# EAGLE design EMG-bi-single (EAGLE 7.1.0)
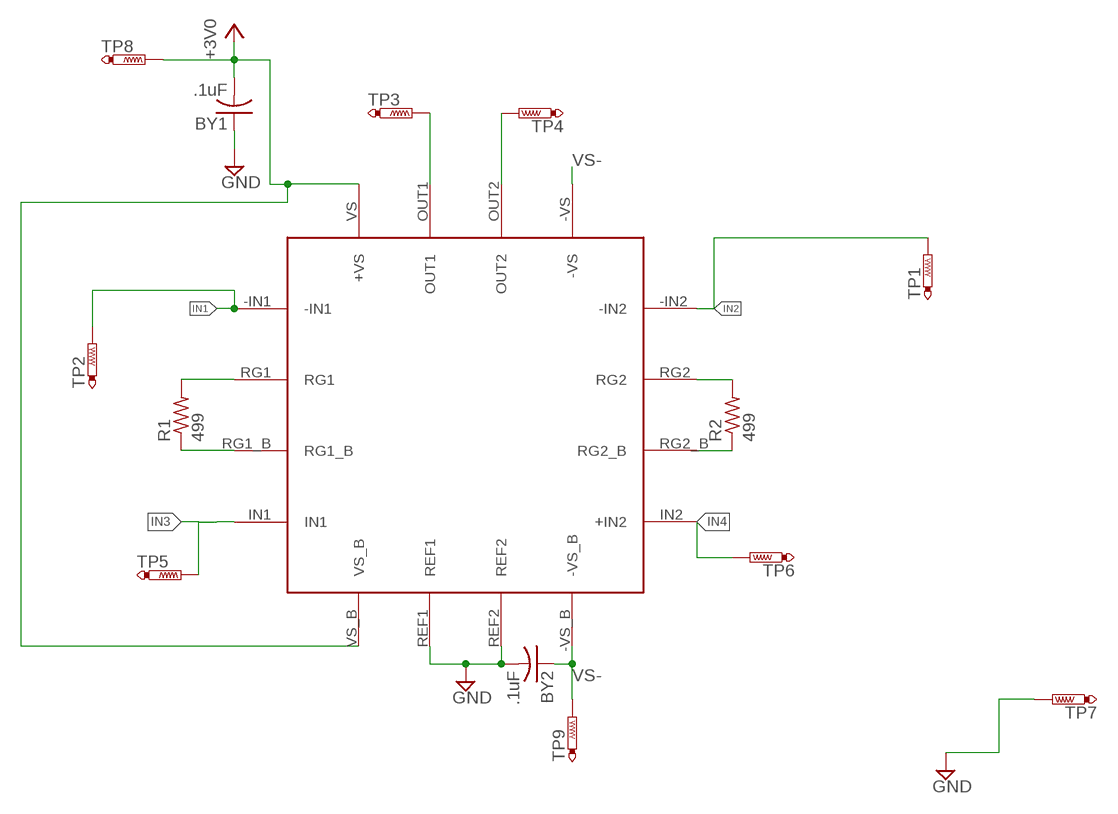
[diagram p0: schematic, sheet 1]

## Parts
BY1  .1uF  C-USC0805  [C0805]
BY2  .1uF  C-USC0805  [C0805]
R1  499  R-US_R0805  [R0805]
R2  499  R-US_R0805  [R0805]
TP1  PTR1TP20SQ  [TP20SQ]
TP2  PTR1TP20SQ  [TP20SQ]
TP3  PTR1TP20SQ  [TP20SQ]
TP4  PTR1TP20SQ  [TP20SQ]
TP5  PTR1TP20SQ  [TP20SQ]
TP6  PTR1TP20SQ  [TP20SQ]
TP7  PTR1TP20SQ  [TP20SQ]
TP8  PTR1TP20SQ  [TP20SQ]
TP9  PTR1TP20SQ  [TP20SQ]
U$9  AD8222  [QFN-16]

## Nets
+3V0: BY1.2 TP8.TP U$9.VS(+VS) U$9.VS_B
GND: BY1.1 BY2.2 TP7.TP U$9.REF1 U$9.REF2
IN1: TP2.TP U$9.-IN1
IN2: TP1.TP U$9.-IN2
IN3: TP5.TP U$9.IN1
IN4: TP6.TP U$9.IN2(+IN2)
N$1: R1.2 U$9.RG1
N$2: R1.1 U$9.RG1_B
N$3: R2.2 U$9.RG2
N$4: TP3.TP U$9.OUT1
N$5: R2.1 U$9.RG2_B
N$6: TP4.TP U$9.OUT2
VS-: BY2.1 TP9.TP U$9.-VS U$9.-VS_B

## Library data of the parts
BY1 BY2 = adafruit:C-US: CAPACITOR, American symbol
R1 R2 = adafruit:R-US_: RESISTOR, American symbol
TP1-TP9 = testpad:PTR1: TEST PIN
U$9 = kushal:AD8222

## Board
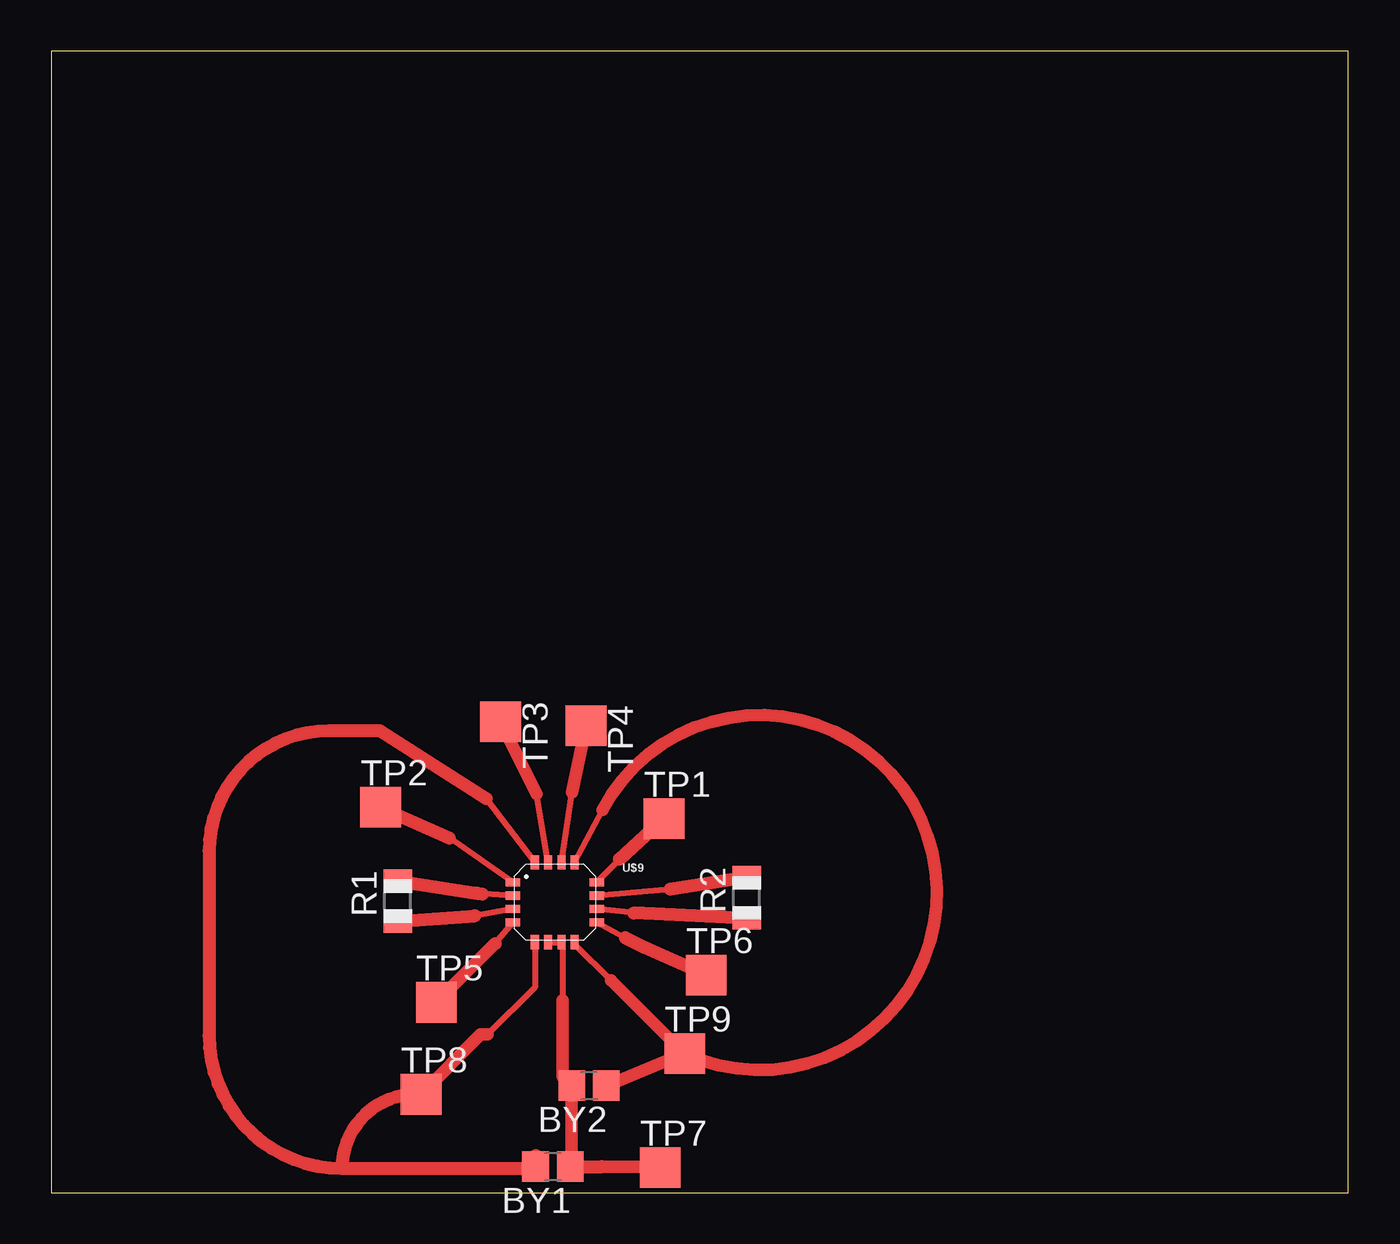
[diagram p1: board, top side]

Size 63.5 x 55.88 mm. Coordinates in mm from the lower left corner, seen from the top.
Outline: 0,0 63.5,0 63.5,55.88 0,55.88 0,0
Copper layers (1*16): Top 0.035mm / dielectric 1.5mm / Bottom 0.035mm
Design rules "4pcb": minimum track width 8mil, minimum drill 10mil, track to track 8mil, track to pad 8mil, pad to pad 8mil, via to via 8mil, smd to smd 8mil, copper to edge 10mil, drill to drill 8mil, minimum pad ring 10mil, minimum via ring 8mil, stop-mask expansion 4mil, vias tented up to drill 0mil, thermal gap 10mil

### Footprints (pad centres in the part's own frame; a part is rotated, then mirrored left to right if it is on the bottom)
C0805 = smd 1.3 x 1.5: 1 -0.85,0; 2 0.85,0
R0805 = smd 1.1 x 1.4: 1 -1,0; 2 1,0
TP20SQ = smd 2 x 2: TP 0,0
QFN-16 = smd 0.7 x 0.4: -IN1 -2.05,0.975; -IN2 2.05,0.975; IN1 -2.05,-0.975; IN2 2.05,-0.975; RG1 -2.05,0.325; RG1_B -2.05,-0.325; RG2 2.05,0.325; RG2_B 2.05,-0.325 | smd 0.4 x 0.7: -VS 0.975,1.95; -VS_B 0.975,-1.95; OUT1 -0.325,1.95; OUT2 0.325,1.95; REF1 -0.325,-1.95; REF2 0.325,-1.95; VS -0.975,1.95; VS_B -0.975,-1.95

### Placement (x,y rotation side)
BY1  24.56,1.28 180 top
BY2  26.33,5.24 180 top
R1  16.97,14.27 90 top
R2  34.05,14.44 90 top
TP1  30,18.31 0 top
TP2  16.13,18.87 0 top
TP3  22.01,23.05 270 top
TP4  26.18,22.85 270 top
TP5  18.85,9.31 0 top
TP6  32.07,10.65 0 top
TP7  29.81,1.23 0 top
TP8  18.11,4.81 0 top
TP9  31.01,6.81 0 top
U$9  24.65,14.21 0 top

### Tracks (layer width: path | path; a pad name or v marks a point on that pad's centre or on a via)
+3V0
  Top 0.305: U$9.VS 21.31,19.28 | U$9.VS_B 23.68,10.06 21.36,7.74
  Top 0.61: 21.36,7.74 21.03,7.74 TP8.TP
  Top 0.635: BY1.2 23.72,1.82 arc-90 23.08,1.19 14.24,1.19 | 21.31,19.28 16.1,22.61 13.6,22.61 arc90 7.73,16.74 7.73,7.69 arc90 14.24,1.19 | TP8.TP 17.86,4.81 arc90 14.24,1.19
GND
  Top 0.305: U$9.REF1 U$9.REF2 25.03,12.26 25.03,9.43
  Top 0.61: TP7.TP 29.77,1.27 BY1.1 25.48,1.34 BY2.2 25.03,5.69 25.03,9.43
  Top 0.635: BY1.1 26.96,1.27
IN1
  Top 0.305: U$9.-IN1 19.5,17.36
  Top 0.635: TP2.TP 19.5,17.36
IN2
  Top 0.305: 27.82,16.32 U$9.-IN2
  Top 0.635: TP1.TP 27.82,16.32
IN3
  Top 0.305: 21.74,12.19 U$9.IN1
  Top 0.635: TP5.TP 21.74,12.19
IN4
  Top 0.305: 28.09,12.48 U$9.IN2
  Top 0.635: TP6.TP 29.07,11.99 28.09,12.48
N$1
  Top 0.305: U$9.RG1 20.87,14.66
  Top 0.635: R1.2 20.87,14.66 21.11,14.62
N$2
  Top 0.305: U$9.RG1_B 20.75,13.56
  Top 0.635: R1.1 20.75,13.56
N$3
  Top 0.305: 30.32,14.85 U$9.RG2
  Top 0.635: R2.2 30.32,14.85
N$4
  Top 0.305: U$9.OUT1 23.75,19.52
  Top 0.61: TP3.TP 23.75,19.52
N$5
  Top 0.305: 28.53,13.7 U$9.RG2_B
  Top 0.635: R2.1 28.53,13.7
N$6
  Top 0.305: U$9.OUT2 25.49,19.59
  Top 0.61: TP4.TP 25.49,19.59
VS-
  Top 0.305: U$9.-VS_B 25.63,12.16 27.4,10.39 | U$9.-VS 26.99,18.74
  Top 0.61: TP9.TP BY2.1 | TP9.TP 30.98,6.81 27.4,10.39 | 26.99,18.74 arc-267 TP9.TP